# EAGLE schematic board (EAGLE 9.1.3)
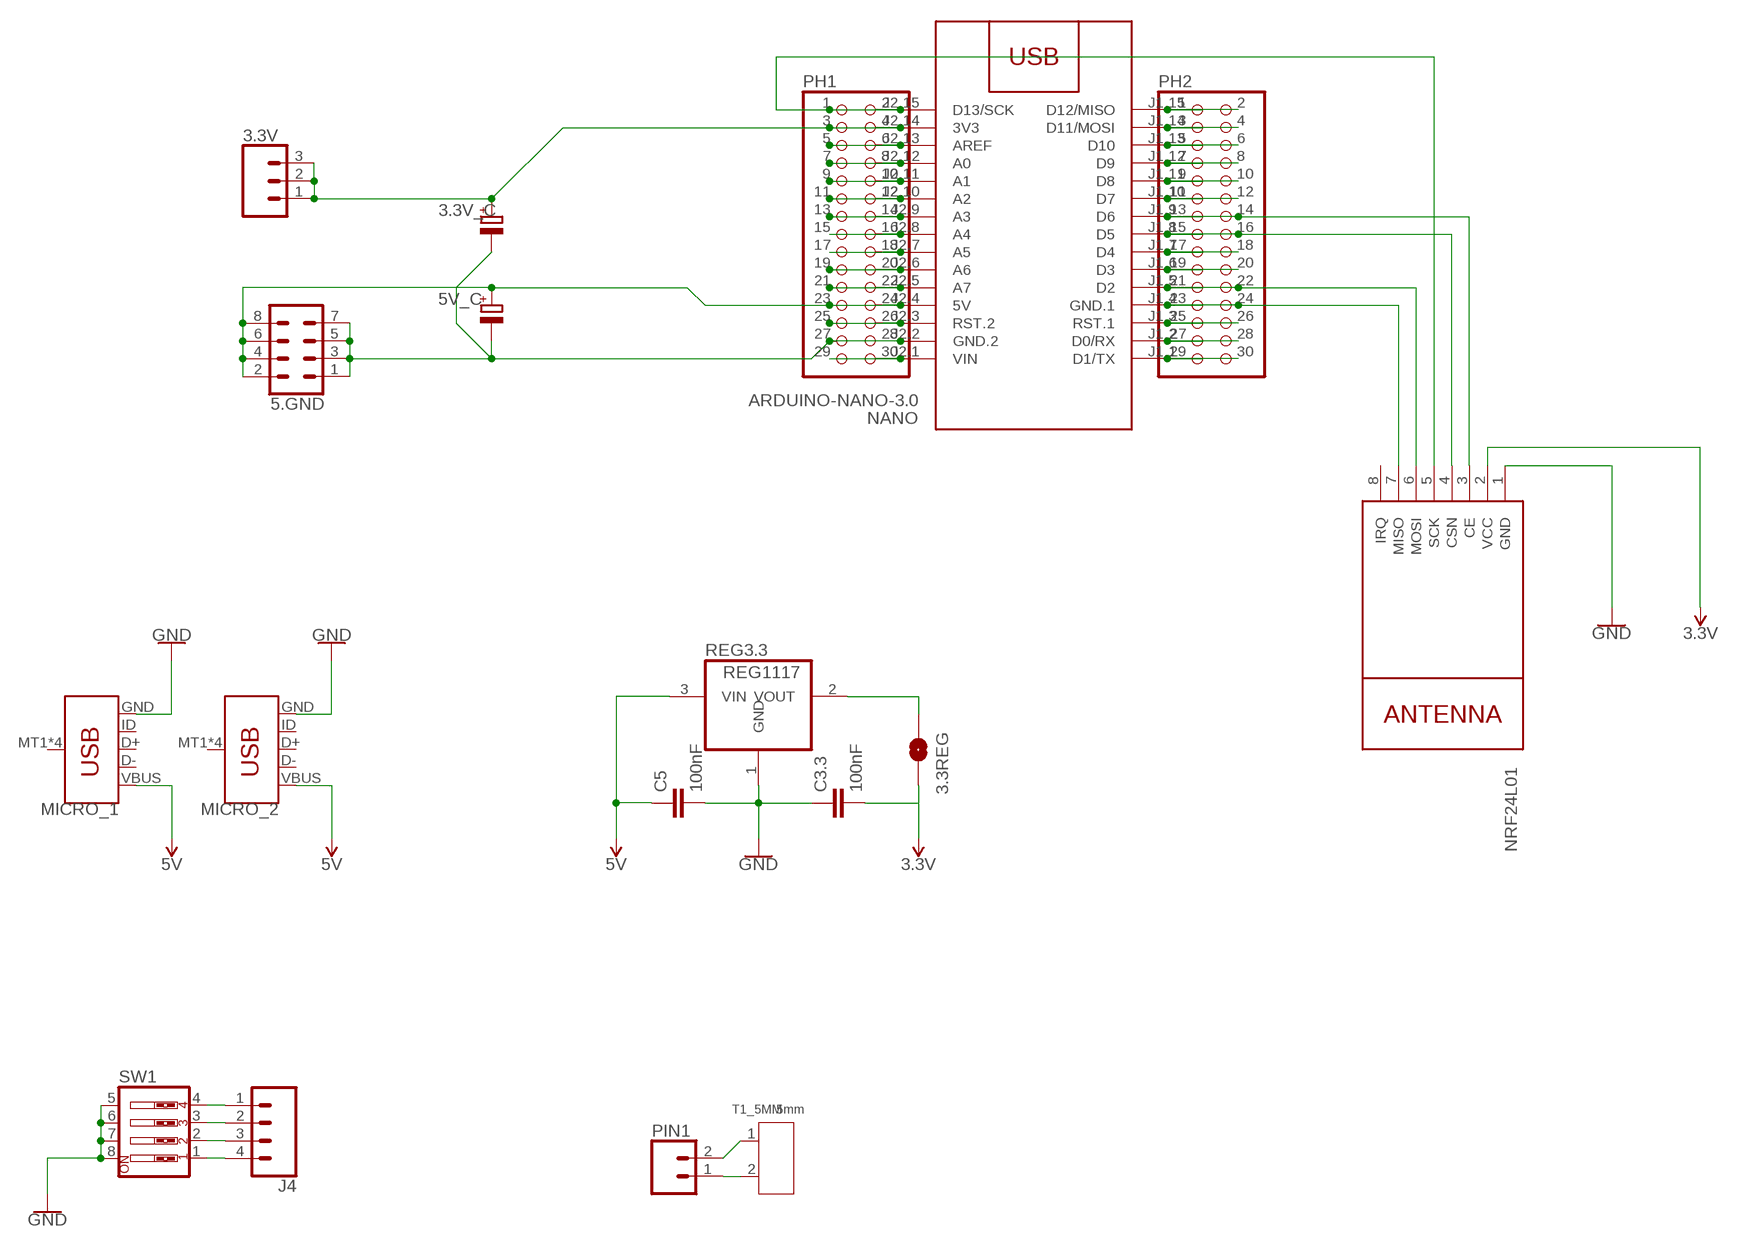
[diagram p0: schematic, sheet 1]

## Parts
3.3REG  JUMPER-SMT_2_NO_NO-SILK  [SMT-JUMPER_2_NO_NO-SILK]
3.3V  CONN_03LOCK  [1X03_LOCK]
3.3V_C  CPOL-EUD  [PANASONIC_D]
5.GND  CONN_04X2  [2X4]
5V_C  CPOL-EUD  [PANASONIC_D]
C3.3  100nF  C-EUC0805  [C0805]
C5  100nF  C-EUC0805  [C0805]
J4  CONN_04LOCK  [1X04_LOCK]
MICRO_1  USB_MICRO-B_SMT  [USB-MICROB]
MICRO_2  USB_MICRO-B_SMT  [USB-MICROB]
NANO  ARDUINO-NANO-3.0  [ARDUINO-NANO-3.0]
NRF24L01  WIRELESS-NRF24L01  [WIRELESS-NRF24L01]
PH1  PINHD-2X15  [2X15]
PH2  PINHD-2X15  [2X15]
PIN1  CONN_02LOCK  [1X02_LOCK]
REG3.3  REG1117  [SOT223]
SW1  SW_DIP-4  [EDG-04]
T1_5MM  5mm  SCREW-TERMINAL-GREEN(2P-5.0)  [H2-5.0-10.5X8.0MM]

## Nets
3.3V [power]: 3.3V.1 3.3V.2 3.3V.3 3.3V_C.+ NANO.J2.14(3V3) NRF24L01.2(VCC) PH1.3 PH1.4
5V [power]: 5.GND.2 5.GND.4 5.GND.6 5.GND.8 5V_C.+ C5.1 MICRO_1.VBUS MICRO_2.VBUS NANO.J2.4(5V) PH1.23 PH1.24 REG3.3.3(VIN)
A5: NANO.J2.7(A5) PH1.17 PH1.18
A6: NANO.J2.6(A6) PH1.19 PH1.20
A7: NANO.J2.5(A7) PH1.21 PH1.22
CE_NRF: NANO.J1.9(D6) NRF24L01.3(CE) PH2.13 PH2.14
CSN_NRF: NANO.J1.8(D5) NRF24L01.4(CSN) PH2.15 PH2.16
GND [power]: 3.3V_C.- 5.GND.1 5.GND.3 5.GND.5 5.GND.7 5V_C.- C3.3.1 C5.2 MICRO_1.GND MICRO_2.GND NANO.J2.2(GND.2) NRF24L01.1(GND) PH1.27 PH1.28 REG3.3.1(GND) SW1.5 SW1.6 SW1.7 SW1.8
MISO_NRF: NANO.J1.4(GND.1) NRF24L01.7(MISO) PH2.23 PH2.24
MOSI_NRF: NANO.J1.5(D2) NRF24L01.6(MOSI) PH2.21 PH2.22
N$1 [power]: 3.3REG.2 C3.3.2
N$2 [power]: 3.3REG.1 REG3.3.2(VOUT)
N$3: NANO.J2.13(AREF) PH1.5 PH1.6
N$4: NANO.J2.12(A0) PH1.7 PH1.8
N$5: NANO.J2.11(A1) PH1.9 PH1.10
N$6: NANO.J2.10(A2) PH1.11 PH1.12
N$7: NANO.J2.9(A3) PH1.13 PH1.14
N$8: NANO.J2.8(A4) PH1.15 PH1.16
N$16: NANO.J1.15(D12/MISO) PH2.1 PH2.2
N$17: NANO.J1.14(D11/MOSI) PH2.3 PH2.4
N$18: NANO.J1.13(D10) PH2.5 PH2.6
N$19: NANO.J1.12(D9) PH2.7 PH2.8
N$20: NANO.J1.11(D8) PH2.9 PH2.10
N$21: NANO.J1.10(D7) PH2.11 PH2.12
N$23 [terminal]: PIN1.2 T1_5MM.1
N$24: NANO.J1.7(D4) PH2.17 PH2.18
N$25: NANO.J1.6(D3) PH2.19 PH2.20
N$26 [terminal]: PIN1.1 T1_5MM.2
N$28: NANO.J1.3(RST.1) PH2.25 PH2.26
N$29: NANO.J1.2(D0/RX) PH2.27 PH2.28
N$30: NANO.J1.1(D1/TX) PH2.29 PH2.30
N$39 [power]: J4.1 SW1.4
N$40 [power]: J4.2 SW1.3
N$41 [power]: J4.3 SW1.2
N$42 [power]: J4.4 SW1.1
RST: NANO.J2.3(RST.2) PH1.25 PH1.26
SCK_NRF: NANO.J2.15(D13/SCK) NRF24L01.5(SCK) PH1.1 PH1.2
VIN [power]: NANO.J2.1(VIN) PH1.29 PH1.30
Unconnected: MICRO_1.D+ MICRO_1.D- MICRO_1.ID MICRO_1.MT1(SHIELD) MICRO_1.MT2(SHIELD) MICRO_1.P$1(SHIELD) MICRO_1.P$2(SHIELD) MICRO_2.D+ MICRO_2.D- MICRO_2.ID MICRO_2.MT1(SHIELD) MICRO_2.MT2(SHIELD) MICRO_2.P$1(SHIELD) MICRO_2.P$2(SHIELD) NRF24L01.8(IRQ)

## Library data of the parts
3.3REG = SparkFun-Jumpers:JUMPER-SMT_2_NO: Normally open jumper This jumper has two pads in close proximity to each other. Apply solder to close the connection. Round pads are easier to solder for beginners, but are a lot larger. SparkFun Product that uses the round pads: SparkFun EL Sequencer <https://www.sparkfun.com/products/12781>
3.3V = SparkFun-Connectors:CONN_03: Multi connection point. Often used as Generic Header-pin footprint for 0.1 inch spaced/style header connections On any of the 0.1 inch spaced packages, you can populate with these: Break Away Headers - Straight <https://www.sparkfun.com/products/116> (PRT-00116) Break Away Male Headers - Right Angle <https://www.sparkfun.com/products/553> (PRT-00553) Female Headers <https://www.sparkfun.com/products/115> (PRT-00115) Break Away Headers - Machine Pin <https://www.sparkfun.com/products/117> (PRT-00117) Break Away Female Headers - Swiss Machine Pin <https://www.sparkfun.com/products/743> (PRT-00743) Stackable Header - 3 Pin (Female, 0.1") <https://www.sparkfun.com/products/13875> (PRT-13875) For SCREWTERMINALS and SPRING TERMINALS visit here: Screw Terimnals on SparkFun.com <https://www.sparkfun.com/search/results?term=Screw+Terminals> (5mm/3.5mm/2.54mm spacing) This device is also useful as a general connection point to wire up your design to another part of your project. Our various solder wires solder well into these plated through hole pads. Hook-Up Wire - Assortment (Stranded, 22 AWG) <https://www.sparkfun.com/products/11375> (PRT-11375) Hook-Up Wire - Assortment (Solid Core, 22 AWG) <https://www.sparkfun.com/products/11367> (PRT-11367) View the entire wire category on our website here <https://www.sparkfun.com/categories/141> Special notes: Molex polarized connector foot print use with SKU : PRT-08232 with associated crimp pins and housings.
3.3V_C 5V_C = rcl:CPOL-EU: POLARIZED CAPACITOR, European symbol
5.GND = SparkFun-Connectors:CONN_04X2: Multi connection point. Often used as Generic Header-pin footprint for 0.1 inch spaced/style header connections On any of the 0.1 inch spaced packages, you can populate with these: Break Away Headers - Straight <https://www.sparkfun.com/products/116> (PRT-00116) Break Away Male Headers - Right Angle <https://www.sparkfun.com/products/553> (PRT-00553) Female Headers <https://www.sparkfun.com/products/115> (PRT-00115) Break Away Headers - Machine Pin <https://www.sparkfun.com/products/117> (PRT-00117) Break Away Female Headers - Swiss Machine Pin <https://www.sparkfun.com/products/743> (PRT-00743)
C3.3 C5 = rcl:C-EU: CAPACITOR, European symbol; SPICEPREFIX: C
J4 = SparkFun-Connectors:CONN_04: Multi connection point. Often used as Generic Header-pin footprint for 0.1 inch spaced/style header connections On any of the 0.1 inch spaced packages, you can populate with these: Break Away Headers - Straight <https://www.sparkfun.com/products/116> (PRT-00116) Break Away Male Headers - Right Angle <https://www.sparkfun.com/products/553> (PRT-00553) Female Headers <https://www.sparkfun.com/products/115> (PRT-00115) Break Away Headers - Machine Pin <https://www.sparkfun.com/products/117> (PRT-00117) Break Away Female Headers - Swiss Machine Pin <https://www.sparkfun.com/products/743> (PRT-00743) For SCREWTERMINALS and SPRING TERMINALS visit here: Screw Terimnals on SparkFun.com <https://www.sparkfun.com/search/results?term=Screw+Terminals> (5mm/3.5mm/2.54mm spacing) This device is also useful as a general connection point to wire up your design to another part of your project. Our various solder wires solder well into these plated through hole pads. Hook-Up Wire - Assortment (Stranded, 22 AWG) <https://www.sparkfun.com/products/11375> (PRT-11375) Hook-Up Wire - Assortment (Solid Core, 22 AWG) <https://www.sparkfun.com/products/11367> (PRT-11367) View the entire wire category on our website here <https://www.sparkfun.com/categories/141> Special notes: Molex polarized connector foot print use with SKU : PRT-08231 with associated crimp pins and housings. 1MM SMD Version SKU: PRT-10208; PROD_ID: CONN-09696
MICRO_1 MICRO_2 = SparkFun-Connectors:USB_MICRO-B: USB Type Micro-B Connector Male/female and PTH/SMT variants SparkFun Products: SparkFun microB USB Breakout <https://www.sparkfun.com/products/12035> SparkFun USB microB Plug Breakout <https://www.sparkfun.com/products/10031> SparkFun ESP8266 Thing <https://www.sparkfun.com/products/13231>; PROD_ID: CONN-09505; SF_ID: PRT-08533
NANO = diy-modules:ARDUINO-NANO-3.0: Arduino Nano 3.0 and compatible devices More details available here: https://www.arduino.cc/en/Main/ArduinoBoardNano Click here to find device on ebay.com <http://www.ebay.com/sch/arduino+nano>
NRF24L01 = diy-modules:WIRELESS-NRF24L01: 2.4 GHz Wireless Module based on NRF24L01 chip More details available here: http://www.electrodragon.com/w/NRF24L01 Click here to find device on ebay.com <http://www.ebay.com/sch/nrf24l01+arduino>
PH1 PH2 = pinhead:PINHD-2X15: PIN HEADER
PIN1 = SparkFun-Connectors:CONN_02: Multi connection point. Often used as Generic Header-pin footprint for 0.1 inch spaced/style header connections On any of the 0.1 inch spaced packages, you can populate with these: Break Away Headers - Straight <https://www.sparkfun.com/products/116> (PRT-00116) Break Away Male Headers - Right Angle <https://www.sparkfun.com/products/553> (PRT-00553) Female Headers <https://www.sparkfun.com/products/115> (PRT-00115) Break Away Headers - Machine Pin <https://www.sparkfun.com/products/117> (PRT-00117) Break Away Female Headers - Swiss Machine Pin <https://www.sparkfun.com/products/743> (PRT-00743) For SCREWTERMINALS and SPRING TERMINALS visit here: Screw Terimnals on SparkFun.com <https://www.sparkfun.com/search/results?term=Screw+Terminals> (5mm/3.5mm/2.54mm spacing) This device is also useful as a general connection point to wire up your design to another part of your project. Our various solder wires solder well into these plated through hole pads. Hook-Up Wire - Assortment (Stranded, 22 AWG) <https://www.sparkfun.com/products/11375> (PRT-11375) Hook-Up Wire - Assortment (Solid Core, 22 AWG) <https://www.sparkfun.com/products/11367> (PRT-11367) View the entire wire category on our website here <https://www.sparkfun.com/categories/141> Special notes: Molex polarized connector foot print use with: PRT-08233 with associated crimp pins and housings. 2.54_SCREWTERM for use with PRT-10571. 3.5mm Screw Terminal footprints for PRT-08084 5mm Screw Terminal footprints for use with PRT-08432
REG3.3 = burr-brown:REG1117: 800mA and 1A Low Dropout (LDO) Positive Regulator 1.8V, 2.5V, 2.85V, 3.3V, 5V, and Adj; MPN: REG1117; OC_FARNELL: 1097566; OC_NEWARK: 14P6981
SW1 = special:SW_DIP-4: DIP SWITCH
T1_5MM = Seeed-Connector:SCREW-TERMINAL-GREEN(2P-5.0): 320110031; VALUE: GREEN-2P-5.0

## Net classes
0 default: width 0.203 mm, drill 0.127 mm, clearance 0.152 mm
1 power: width 0.762 mm, clearance 0.254 mm
2 terminal: width 2.159 mm, clearance 0.305 mm